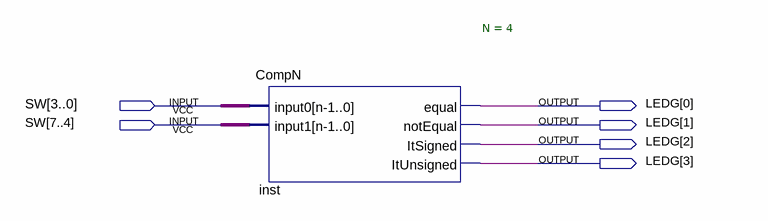
[diagram p0: schematic sheet]
// Quartus schematic CompN_Demo.bdf as structural Verilog: 1 symbols, 6 pins
module CompN_Demo (
  input  [7:0] SW,
  output [3:0] LEDG
);

  CompN #(.N(4)) inst (
    .input0(SW[3:0]), .input1(SW[7:4]), .equal(LEDG[0]), .notEqual(LEDG[1]), .ItSigned(LEDG[2]),
    .ItUnsigned(LEDG[3]));
endmodule
